# EAGLE design ADC - DAC (EAGLE 7.1.0)
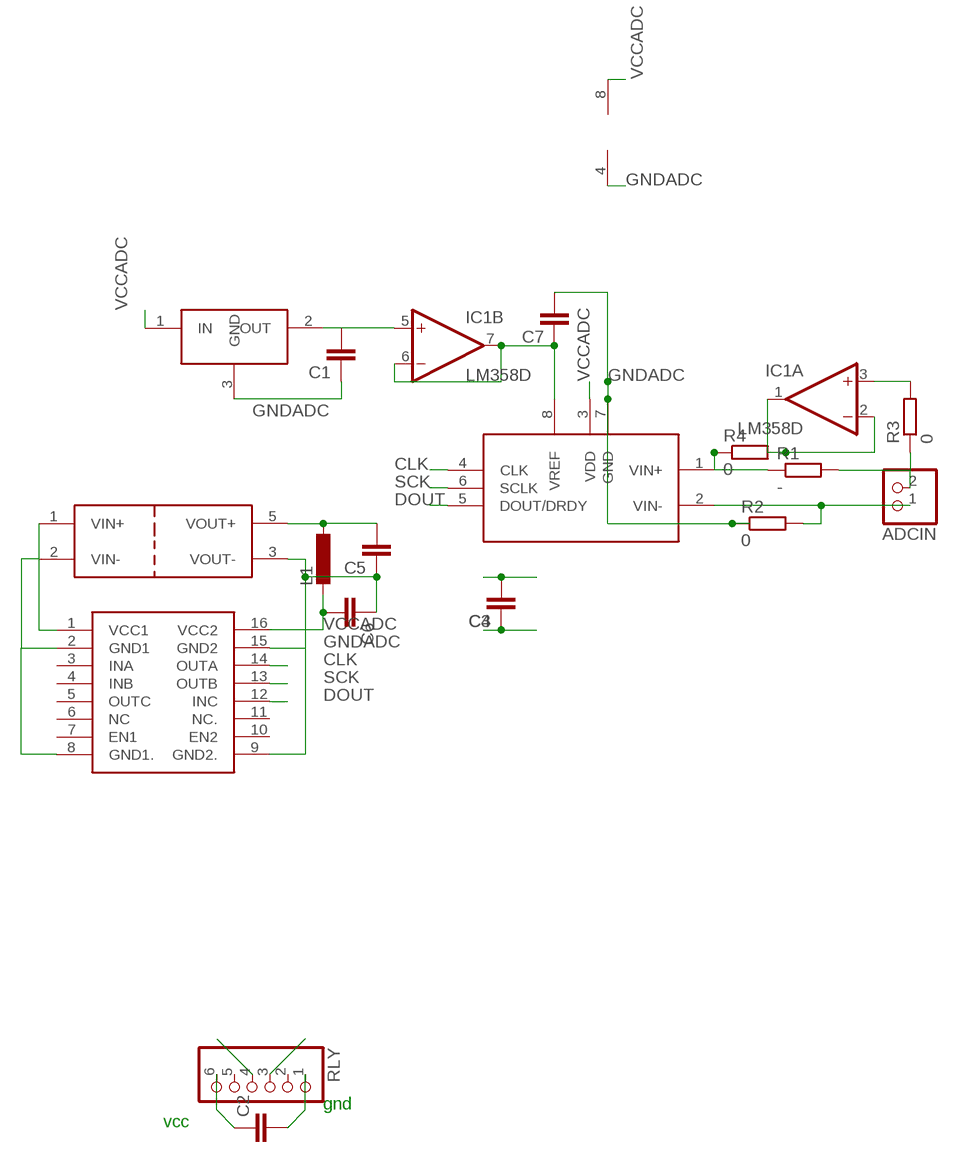
[diagram p0: schematic, sheet 1]

## Parts
ADCIN  PINHD-1X2  [1X02]
C1  C-EUC0805  [C0805]
C2  C-EUC0805  [C0805]
C3  C-EUC0805  [C0805]
C4  C-EUC0805  [C0805]
C5  C-EUC0805  [C0805]
C6  C-EUC0805  [C0805]
C7  C-EUC0805  [C0805]
IC1  LM358D  [SO08]
L1  L-EUL2012C  [L2012C]
R1  -  R-EU_M0805  [M0805]
R2  0  R-EU_M0805  [M0805]
R3  0  R-EU_M0805  [M0805]
R4  0  R-EU_M0805  [M0805]
RLY  PINHD-1X6  [1X06]
U$1  ADS1251U  [SOIC8]
U$2  REF31  [SOT23]
U$3  ISO7631  [SOIC16R]
U$4  DCH01  [DCH01]

## Nets
ADC+: ADCIN.2 R1.2 R3.1
ADC-: ADCIN.1 R2.2 U$1.2(VIN-)
CLK: U$1.4(CLK) U$3.14(OUTA)
DOUT: U$1.5(DOUT/DRDY) U$3.12(INC)
GND2: C2.2 RLY.1
GNDADC: C1.1 C3.1 C4.1 C5.1 C6.1 C7.2 IC1.4(P:V-) R2.1 U$1.7(GND) U$2.3(GND) U$3.9(GND2.) U$3.15(GND2) U$4.3(VOUT-)
N$1: C2.1 RLY.6
N$2: C7.1 IC1.6(B:-IN) IC1.7(B:OUT) U$1.8(VREF)
N$3: C1.2 IC1.5(B:+IN) U$2.2(OUT)
N$4: IC1.1(A:OUT) IC1.2(A:-IN) R4.2
N$5: U$3.2(GND1) U$3.8(GND1.) U$4.2(VIN-)
N$6: U$3.1(VCC1) U$4.1(VIN+)
N$7: C5.2 L1.1 U$4.5(VOUT+)
N$8: IC1.3(A:+IN) R3.2
N$9: R1.1 R4.1 U$1.1(VIN+)
N$23: RLY.4
N$24: RLY.3
SCK: U$1.6(SCLK) U$3.13(OUTB)
VCCADC: C3.2 C4.2 C6.2 IC1.8(P:V+) L1.2 U$1.3(VDD) U$2.1(IN) U$3.16(VCC2)
Unconnected: RLY.2 RLY.5 U$3.3(INA) U$3.4(INB) U$3.5(OUTC) U$3.6(NC) U$3.7(EN1) U$3.10(EN2) U$3.11(NC.)

## Notes on the sheet
- gnd
- vcc

## Library data of the parts
ADCIN = pinhead:PINHD-1X2: PIN HEADER
C1-C7 = resistor:C-EU: CAPACITOR, European symbol; SPICEPREFIX: C
IC1 = linear:LM358: OP AMP also LM158; LM258; LM2904 Source: http://cache.national.com/ds/LM/LM158.pdf
L1 = rcl:L-EU: INDUCTOR, European symbol
R1-R4 = resistor:R-EU_: RESISTOR, European symbol; SPICEPREFIX: R
RLY = pinhead:PINHD-1X6: PIN HEADER
U$1 = RalimTek:ADS1251U: 24-Bit, 20kHz, Low-Power ANALOG-TO-DIGITAL CONVERTER
U$2 = RalimTek:REF31
U$3 = RalimTek:ISO7631
U$4 = RalimTek:DCH01

## Board
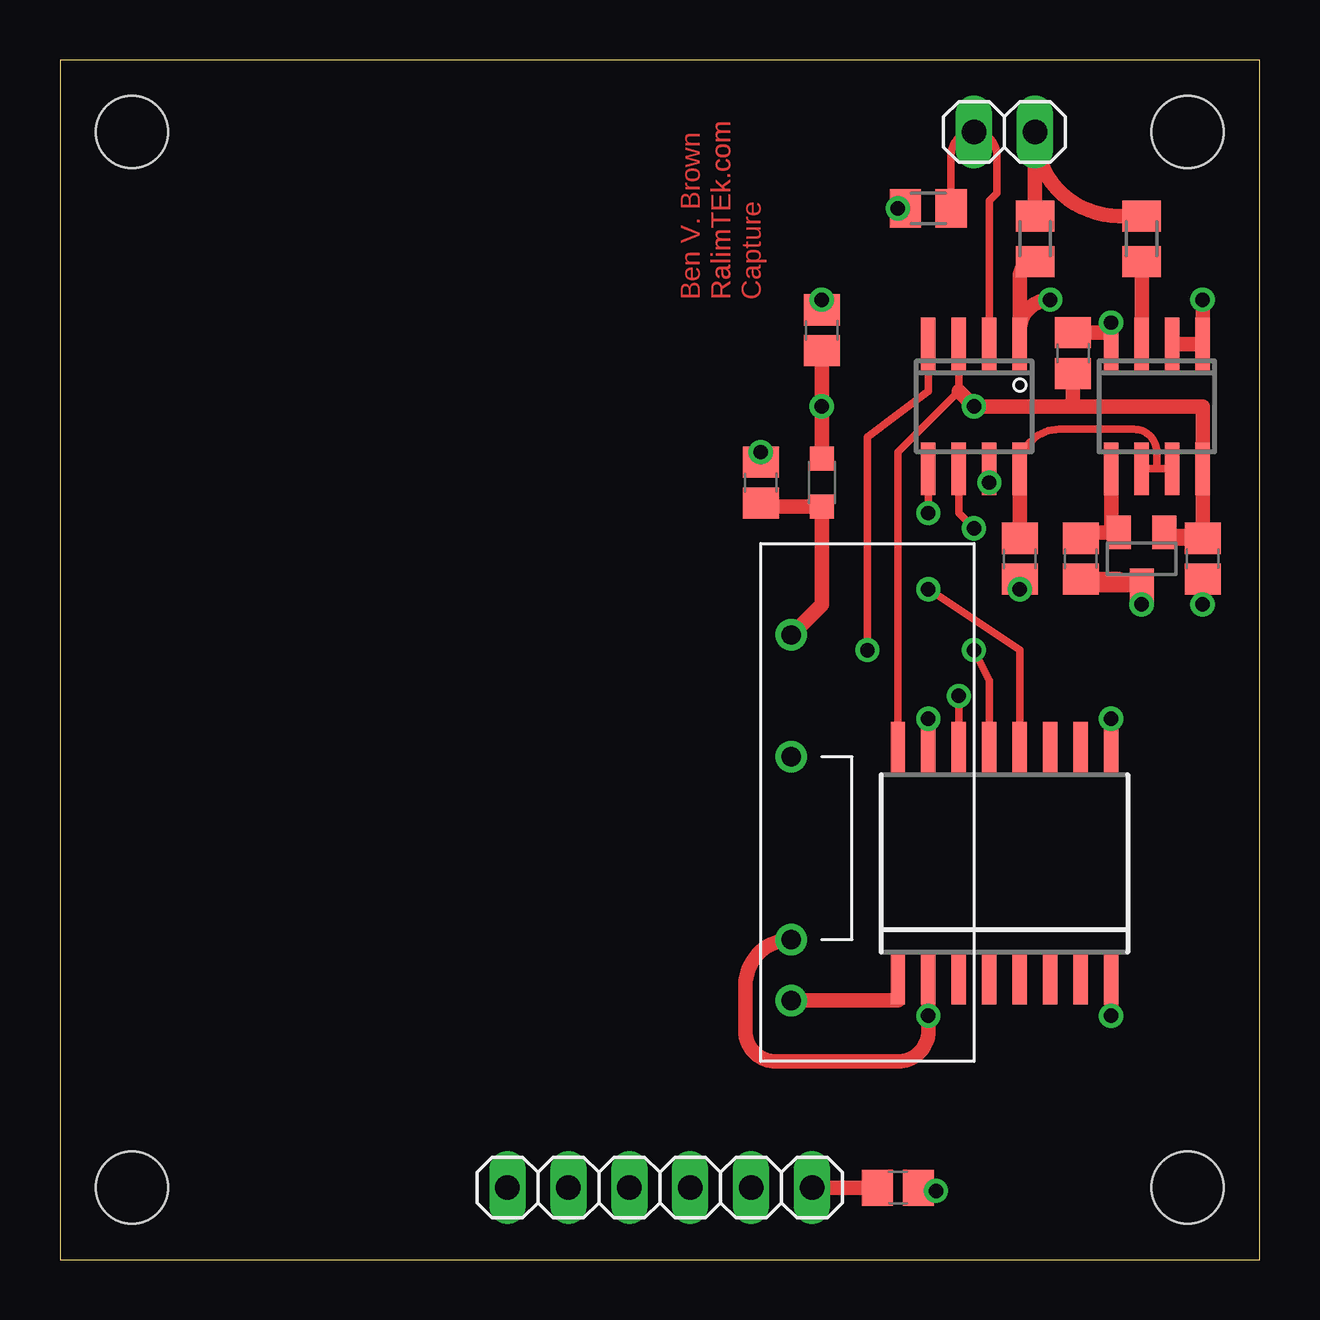
[diagram p1: board, top side]
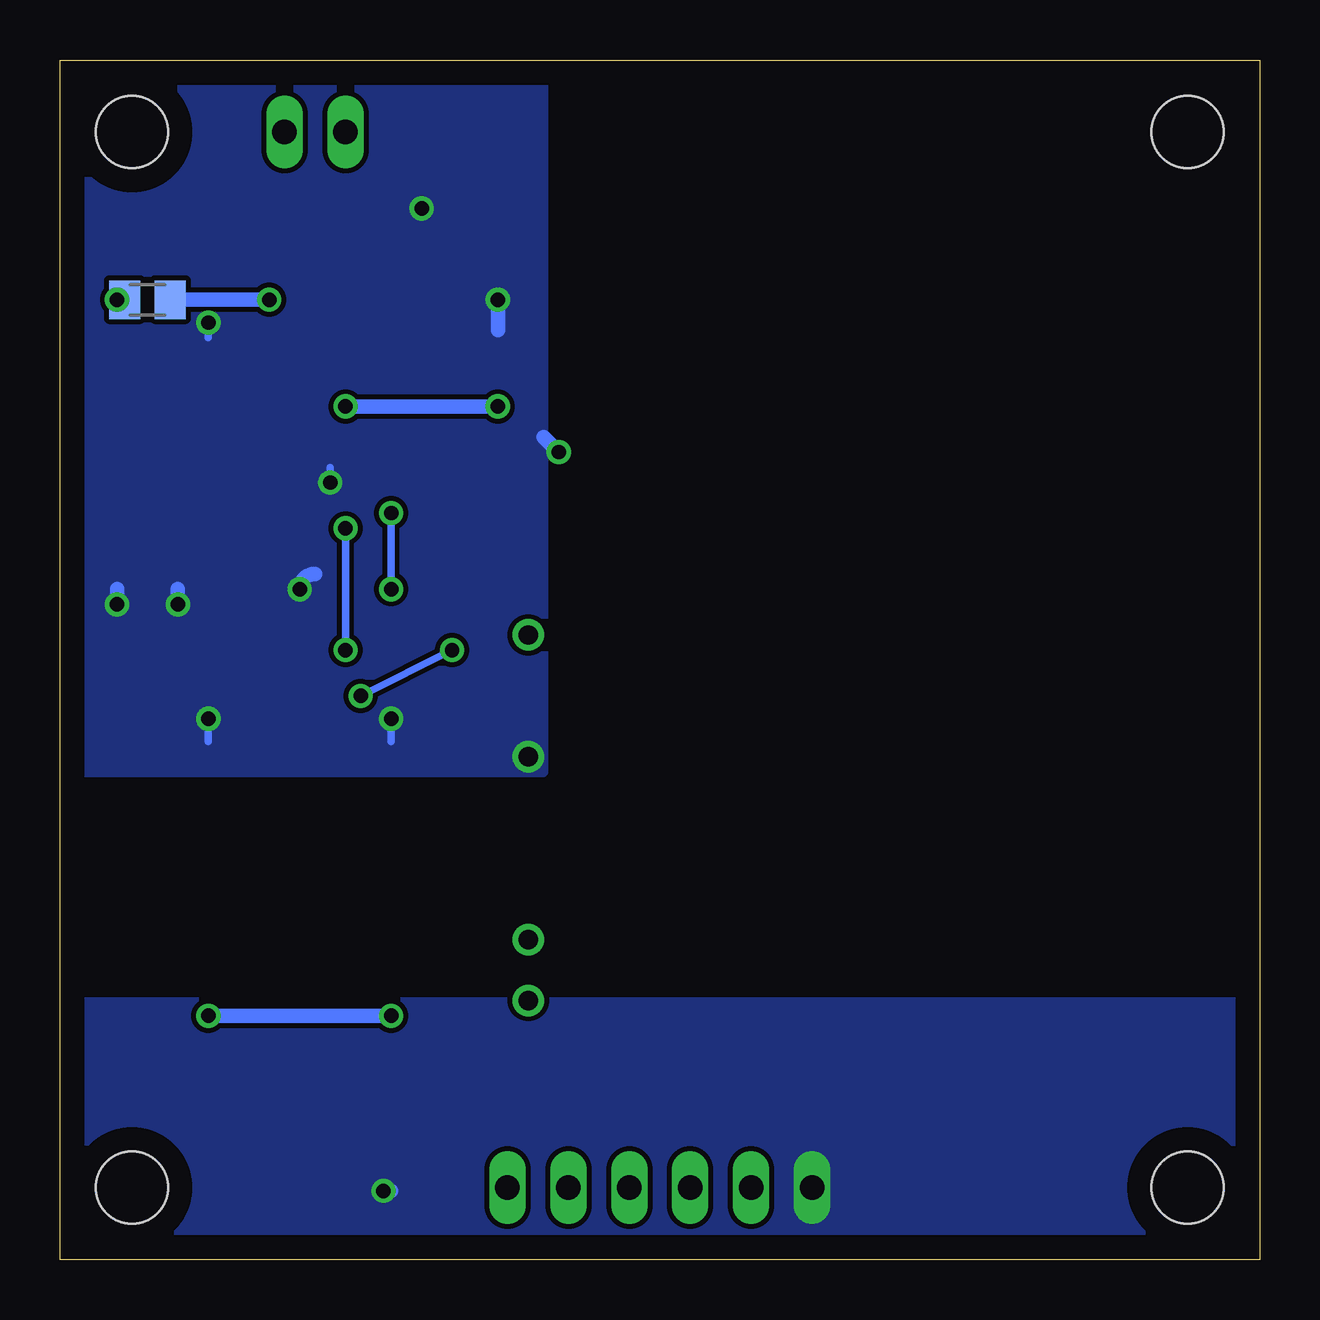
[diagram p2: board, bottom side, seen from below]

Size 50 x 50 mm. Coordinates in mm from the lower left corner, seen from the top.
Outline: 0,0 50,0 50,50 0,50 0,0
Copper layers (1*16): Top 0.035mm / dielectric 1.5mm / Bottom 0.035mm
Design rules "default": minimum track width 10mil, minimum drill 24mil, track to track 8mil, track to pad 8mil, pad to pad 8mil, via to via 8mil, smd to smd 8mil, copper to edge 40mil, drill to drill 8mil, minimum pad ring 10mil, minimum via ring 8mil, stop-mask expansion 4mil, vias tented up to drill 0mil, thermal gap 10mil
Holes 3 mm at 3,3 47,3 47,47 3,47

### Footprints (pad centres in the part's own frame; a part is rotated, then mirrored left to right if it is on the bottom)
1X02 = drill 1.016 long: 1 -1.27,0; 2 1.27,0
C0805 = smd 1.3 x 1.5: 1 -0.85,0; 2 0.85,0
SO08 = smd 0.6 x 2.2: 1 -1.905,-2.6; 2 -0.635,-2.6; 3 0.635,-2.6; 4 1.905,-2.6; 5 1.905,2.6; 6 0.635,2.6; 7 -0.635,2.6; 8 -1.905,2.6
L2012C = smd 1 x 1: 1 -1,0; 2 1,0
M0805 = smd 1.3 x 1.6: 1 -0.95,0; 2 0.95,0
1X06 = drill 1.016 long: 1 -6.35,0; 2 -3.81,0; 3 -1.27,0; 4 1.27,0; 5 3.81,0; 6 6.35,0
SOIC8 = smd 0.6 x 2.2: 1 -1.905,-2.6; 2 -0.635,-2.6; 3 0.635,-2.6; 4 1.905,-2.6; 5 1.905,2.6; 6 0.635,2.6; 7 -0.635,2.6; 8 -1.905,2.6
SOT23 = smd 1 x 1.4: 1 -0.95,-1.1; 2 0.95,-1.1; 3 0,1.1
SOIC16R = smd 0.6 x 2.2: 1 -4.445,-4.775; 2 -3.175,-4.775; 3 -1.905,-4.775; 4 -0.635,-4.775; 5 0.635,-4.775; 6 1.905,-4.775; 7 3.175,-4.775; 8 4.445,-4.775; 9 4.445,4.8; 10 3.175,4.8; 11 1.905,4.8; 12 0.635,4.8; 13 -0.635,4.8; 14 -1.905,4.8; 15 -3.175,4.8; 16 -4.445,4.8
DCH01 = drill 0.8: 1 0,0; 2 2.54,0; 3 10.16,0; 5 15.24,0

### Placement (x,y rotation side)
ADCIN  39.37,47 0 top
C1  42.55,29.21 90 top
C2  34.92,3 0 top
C3  47.62,29.21 90 top
C4  42.23,37.78 270 top
C5  29.21,32.38 270 top
C6  31.75,38.73 270 top
C7  40.01,29.21 270 top
IC1  45.72,35.56 180 top
L1  31.75,32.38 90 top
R1  40.64,42.55 90 top
R2  36.2,43.81 0 top
R3  45.09,42.55 270 top
R4  46.35,40.01 180 bottom
RLY  25,3 0 top
U$1  38.1,35.56 180 top
U$2  45.09,29.21 180 top
U$3  39.37,16.51 0 top
U$4  30.48,10.79 90 top

### Tracks (layer width: path | path; a pad name or v marks a point on that pad's centre or on a via)
ADC+
  Top 0.61: R1.2 ADCIN.2 arc90 44.15,43.49 R3.1
ADC-
  Top 0.305: R2.2 37.15,46.05 arc-90 ADCIN.1 arc-90 39.05,46.05 39.05,44.45 38.73,44.13 U$1.2
CLK  (via drill 0.6)
  Top 0.305: U$1.4 36.2,36.2 33.66,34.29 v33.66,25.4 | v37.47,23.5 U$3.14
  Bottom 0.305: v33.66,25.4 v37.47,23.5
DOUT  (via drill 0.6)
  Top 0.305: U$3.12 40.01,25.4 v36.2,27.94 | v36.2,31.11 U$1.5
  Bottom 0.305: v36.2,27.94 v36.2,31.11
GND2  (via drill 0.6)
  Top 0.61: C2.2 36.37,3 arc-90 v36.51,2.86
  Bottom 0.61: v36.51,2.86 36.2,2.86
  pour Bottom (no thermals): 0,10.79 50.16,10.79 50.16,-0.64 -0.64,-0.64 -0.64,10.79
GNDADC  (via drill 0.6)
  Top 0.305: R2.1 v34.92,43.81 | IC1.4 v43.81,39.05 | U$1.7 v38.73,32.38 | U$3.15 v36.2,22.54 | U$3.9 v43.81,22.54
  Top 0.61: C5.1 v29.21,33.66 | C6.1 v31.75,40.01 | C3.1 v47.62,27.3 | C7.2 v40.01,27.94 | C4.1 43.4,38.63 arc90 v43.81,39.05 | U$2.3 v45.09,27.3 arc90 44.03,28.36 C1.1 42.8,28.11 U$2.3
  Bottom 0.305: v34.92,43.81 R2.1 | v43.81,39.05 43.81,38.42 | v38.73,32.38 38.73,33.02 | v36.2,22.54 36.2,21.59 | v43.81,22.54 43.81,21.59
  Bottom 0.61: v29.21,33.66 29.84,34.29 | v31.75,40.01 31.75,38.73 | v47.62,27.3 47.62,27.94 | v40.01,27.94 arc90 39.37,28.57 | v45.09,27.3 45.09,27.94
  pour Bottom (no thermals): 50.16,20.32 29.84,20.32 29.84,50.8 45.09,50.8 45.09,45.09 50.16,45.09
N$1
  Top 0.61: C2.1 RLY.6
N$2
  Top 0.305: IC1.7 45.72,32.96 | 45.72,32.96 IC1.6 | U$1.8 arc-90 41.65,34.61 44.77,34.61 arc-90 45.72,33.66 45.72,32.96
  Top 0.61: C7.1 U$1.8
N$3
  Top 0.61: IC1.5 43.81,30.63 U$2.2 42.8,30.31 C1.2
N$4  (via drill 0.6)
  Top 0.61: IC1.2 IC1.1 v47.62,40.01
  Bottom 0.61: R4.2 v47.62,40.01
N$5  (via drill 0.6)
  Top 0.61: U$3.2 v36.2,10.16 36.2,9.53 arc-90 34.92,8.26 29.84,8.26 arc-90 28.57,9.53 28.57,11.43 arc-90 U$4.2 | v43.81,10.16 U$3.8
  Bottom 0.61: v36.2,10.16 v43.81,10.16
N$6
  Top 0.61: U$3.1 34.92,10.79 U$4.1
N$7
  Top 0.61: U$4.5 31.75,27.3 L1.1 29.36,31.39 C5.2
N$8
  Top 0.61: IC1.3 R3.2
N$9  (via drill 0.6)
  Top 0.61: R1.1 arc90 40.01,40.96 U$1.1 40.01,38.73 arc-90 v41.27,40.01
  Bottom 0.61: v41.27,40.01 R4.1
SCK  (via drill 0.6)
  Top 0.305: U$3.13 38.73,24.13 v38.1,25.4 | v38.1,30.48 37.47,31.11 U$1.6
  Bottom 0.305: v38.1,25.4 v38.1,30.48
VCCADC  (via drill 0.6)
  Top 0.305: U$1.3 37.47,36.2 34.92,33.66 U$3.16
  Top 0.61: L1.2 v31.75,35.56 C6.2 | 37.47,36.2 v38.1,35.56 41.91,35.56 | 47.62,30.16 C3.2 46.28,30.06 U$2.1 46.18,30.16 47.62,30.16 | 47.62,30.16 IC1.8 47.62,35.56 41.91,35.56 | C4.2 42.23,35.88 arc-90 41.91,35.56
  Bottom 0.61: v31.75,35.56 v38.1,35.56

### Text on the board
Top: Ben V. Brown | RalimTEk.com | RalimTEk.com | Capture
tRestrict: Ben V. Brown | RalimTEk.com | Capture